# Altium project SparkControl.PrjPcb
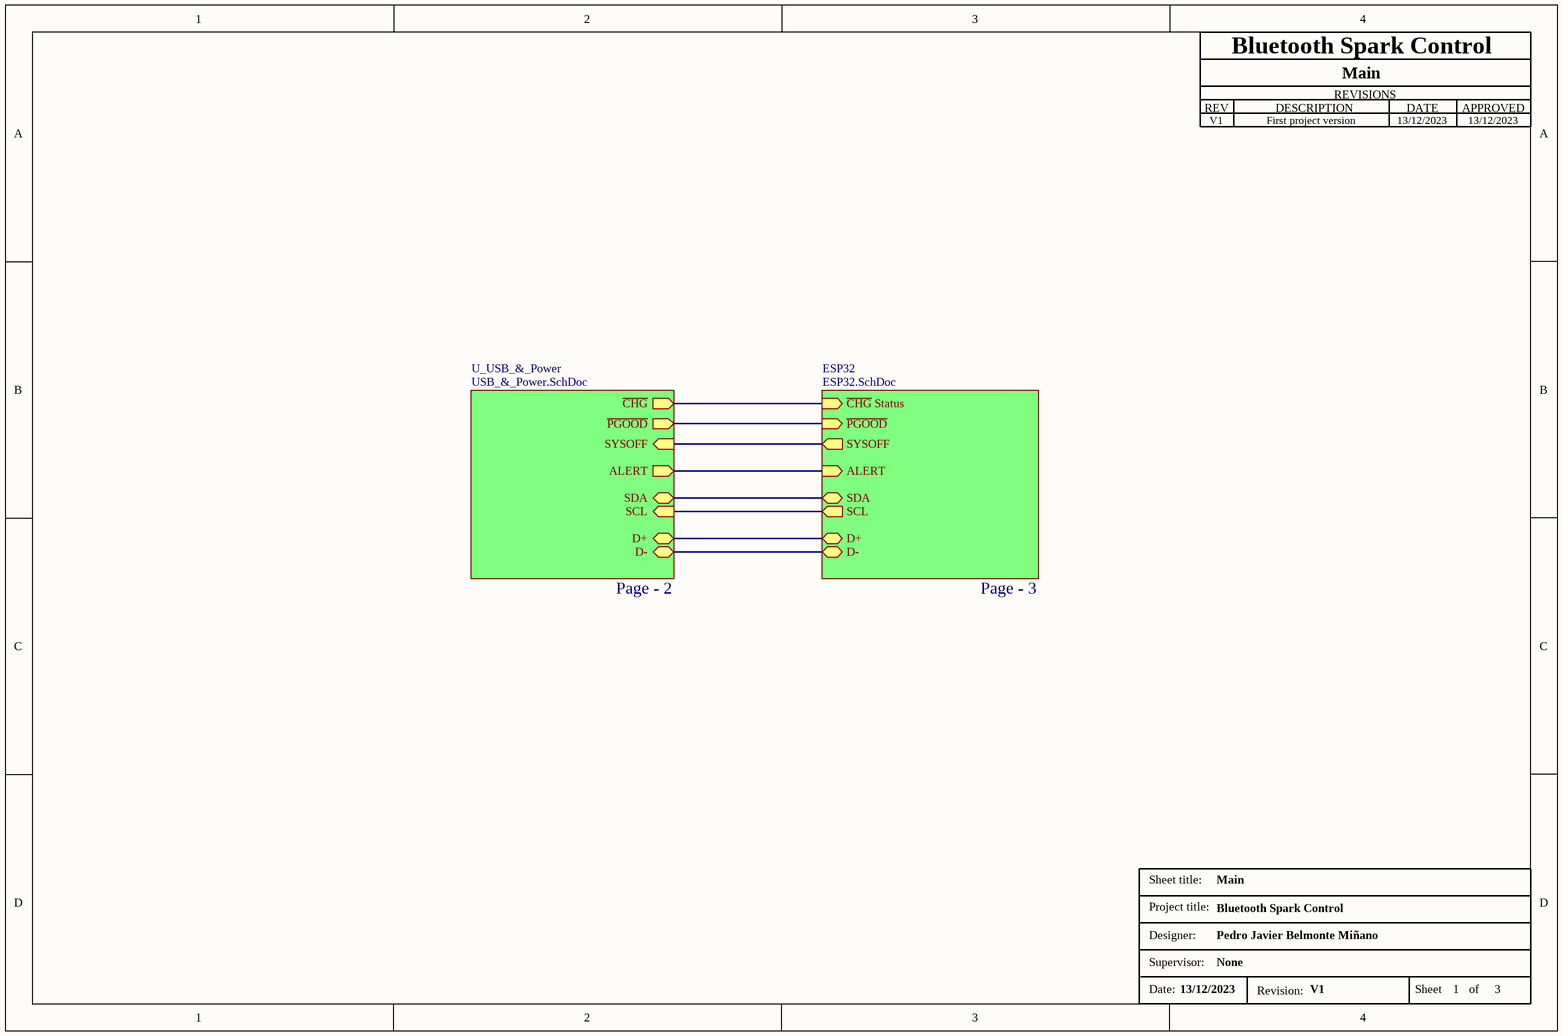
[diagram p0: Main.SchDoc]
ProjectRev: V1; ProjectDate: 13/12/2023; ProjectSupervisor: None; ProjectEngineer: Pedro Javier Belmonte Miñano; ProjectTitle: Bluetooth Spark Control
3 sheets, 57 parts. Net scope: hierarchical (ports join the sheet entries above them; power ports are global).
Board file: SparkControl_V0.1.PcbDoc
Sheets:
  Main.SchDoc
    U_USB_&_Power = USB_&_Power.SchDoc
    ESP32 = ESP32.SchDoc

## Sheet Main.SchDoc: Main
size A4; SheetNumber: 1; SheetTotal: 3

### Sub-sheets
ESP32 = ESP32.SchDoc: ~{CHG} Status (in), ~{PGOOD} (in), D- (bidir), D+ (bidir), ALERT (in), SDA (bidir), SCL (out), SYSOFF (out)
U_USB_&_Power = USB_&_Power.SchDoc: ~{CHG} (out), ~{PGOOD} (out), D- (bidir), D+ (bidir), ALERT (out), SDA (bidir), SCL (in), SYSOFF (in)

### Nets
NRF_N: sheet U_USB_&_Power/D-, sheet ESP32/D-
NRF_P: sheet U_USB_&_Power/D+, sheet ESP32/D+
SCL: sheet U_USB_&_Power/SCL, sheet ESP32/SCL
SDA: sheet U_USB_&_Power/SDA, sheet ESP32/SDA
NetR1_1: sheet U_USB_&_Power/~{PGOOD}, sheet ESP32/~{PGOOD}
NetR2_1: sheet U_USB_&_Power/~{CHG}, sheet ESP32/~{CHG} Status
NetU1_15: sheet U_USB_&_Power/SYSOFF, sheet ESP32/SYSOFF
NetU3_5: sheet U_USB_&_Power/ALERT, sheet ESP32/ALERT

### Notes on the sheet
- REV
- REVISIONS
- DESCRIPTION
- DATE
- APPROVED
- Workaround for Arduino IDE:
  Edit BleKeyboard.h and put #define USE_NIMBLE before the first line
  Edit BleKeyboard.cpp and move line 17 before the first line
  Edit pins number in Config_Definitions.h
  Edit SparkButtonHandler.cpp BfButton false, HIGH to ture, LOW and line 51,53 HIGH to LOW
- V1
- First project version
- 13/12/2023
- Page - 2
- Page - 3
- Sheet title:
- Project title:
- Designer:
- Supervisor:
- Date:
- Revision:
- Sheet
- of

## Sheet USB_&_Power.SchDoc: USB & Power
size A4; DocumentNumber: 2; SheetNumber: 2; SheetTotal: 3
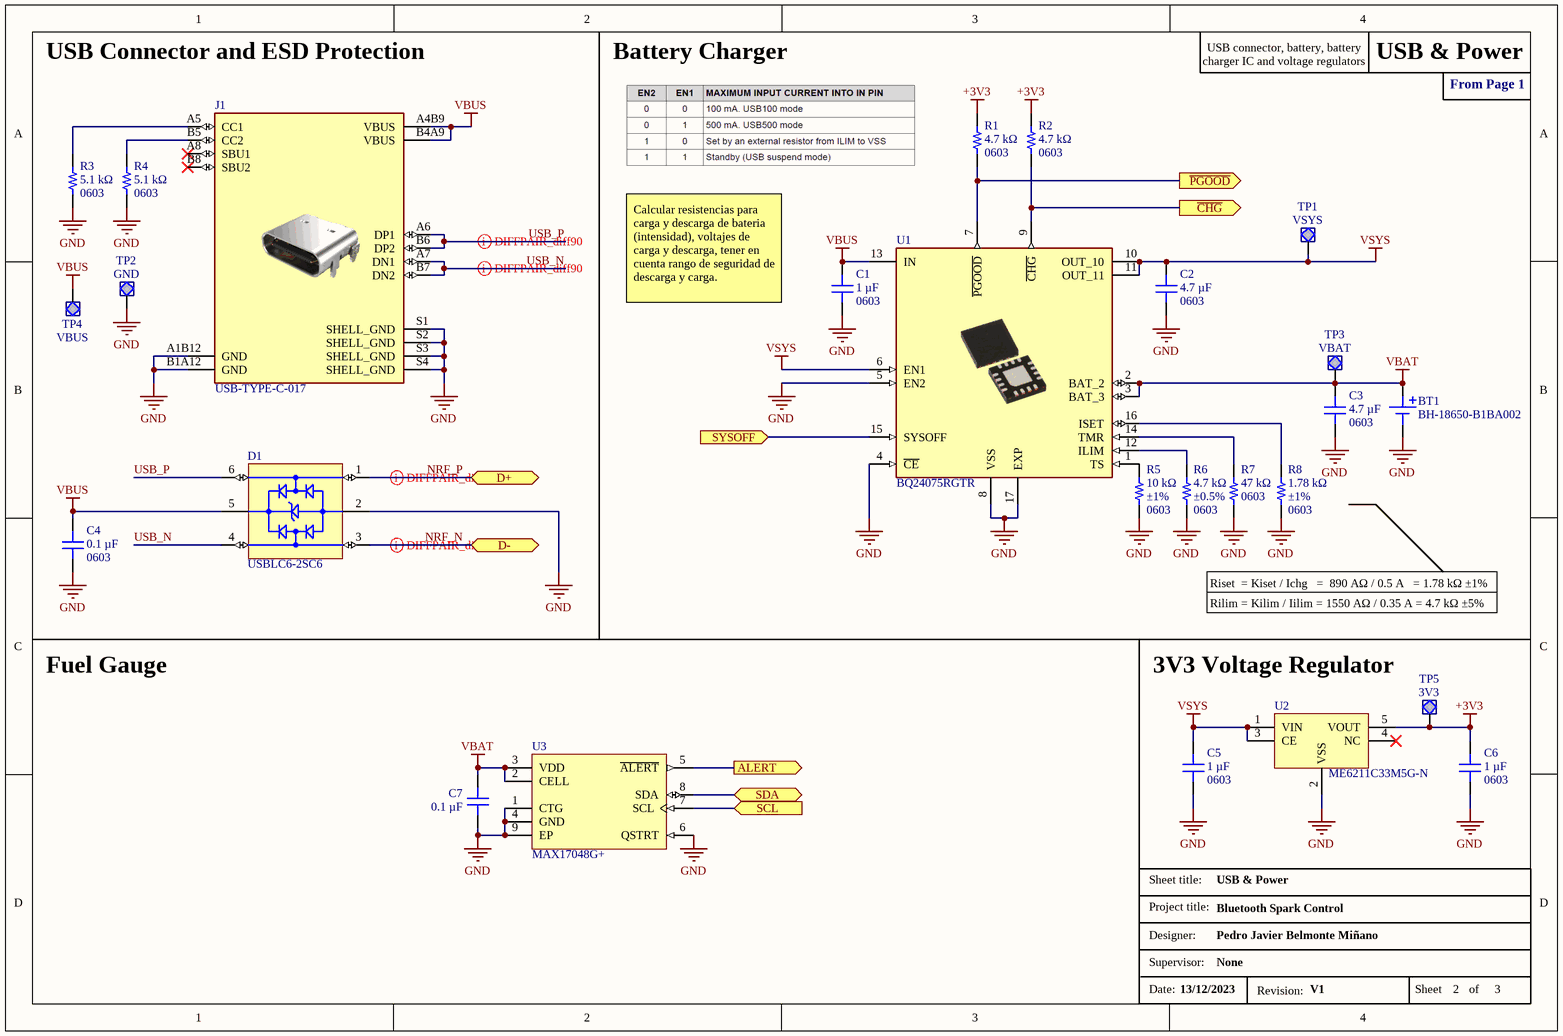
[diagram p1: USB_&_Power.SchDoc]

### Parts
BT1  BH-18650-B1BA002  [BH-18650-B1BA002]
C1  Device Package: 0603  [CAP 0603_1608]  (hidden comment: 1 µF)
C2  Device Package: 0603  [CAP 0603_1608]  (hidden comment: 4.7 µF)
C3  Device Package: 0603  [CAP 0603_1608]  (hidden comment: 4.7 µF)
C4  Device Package: 0603  [CAP 0603_1608]  (hidden comment: 0.1 µF)
C5  Device Package: 0603  [CAP 0603_1608]  (hidden comment: 1 µF)
C6  Device Package: 0603  [CAP 0603_1608]  (hidden comment: 1 µF)
C7  0.1 µF  [CAP 0603_1608]
D1  USBLC6-2SC6  [SOT95P280X145-6N]
J1  USB-TYPE-C-017  [USB-TYPE-C-017]
R1  Device Package: 0603  [RES 0603_1608]  (hidden comment: 4.7 kΩ)
R2  Device Package: 0603  [RES 0603_1608]  (hidden comment: 4.7 kΩ)
R3  Device Package: 0603  [RES 0603_1608]  (hidden comment: 5.1 kΩ)
R4  Device Package: 0603  [RES 0603_1608]  (hidden comment: 5.1 kΩ)
R5  Device Package: 0603  Tolerance: ±1%  [RES 0603_1608]  (hidden comment: 10 kΩ)
R6  Device Package: 0603  Tolerance: ±0.5%  [RES 0603_1608]  (hidden comment: 4.7 kΩ)
R7  Device Package: 0603  [RES 0603_1608]  (hidden comment: 47 kΩ)
R8  Device Package: 0603  Tolerance: ±1%  [RES 0603_1608]  (hidden comment: 1.78 kΩ)
TP1  VSYS  [TestPoint]  (no BOM)
TP2  GND  [TestPoint]  (no BOM)
TP3  VBAT  [TestPoint]  (no BOM)
TP4  VBUS  [TestPoint]  (no BOM)
TP5  3V3  [TestPoint]  (no BOM)
U1  BQ24075RGTR  [QFN50P300X300X100-17N]
U2  ME6211C33M5G-N  [SOT95P270X145-5N]
U3  MAX17048G+  [SON50P200X200X80-9N]

### Ports
ALERT (out, see Main[2B], ESP32[3B]), D+ (bidir, see Main[2C], ESP32[1D]), D- (bidir, see Main[2C], ESP32[1D]), SCL (in, see Main[2B], ESP32[4B]), SDA (bidir, see Main[2B], ESP32[4B]), SYSOFF (in, see Main[2B], ESP32[3B]), ~{CHG} (out, see Main[2B]), ~{PGOOD} (out, see Main[2B], ESP32[3A])

### Nets
+3V3: C6.2 R1.2 R2.2 TP5.1 U2.5(VOUT)
GND: BT1.N(NEG) C1.1 C2.1 C3.1 C4.1 C5.1 C6.1 C7.1 D1.2(GND) J1.A1B12(GND) J1.B1A12(GND) J1.S1(SHELL_GND) J1.S2(SHELL_GND) J1.S3(SHELL_GND) J1.S4(SHELL_GND) R3.1 R4.1 R5.1 R6.1 R7.1 R8.1 TP2.1 U1.4(~{CE}) U1.5(EN2) U1.8(VSS) U1.17(EXP) U2.2(VSS) U3.1(CTG) U3.4(GND) U3.6(QSTRT) U3.9(EP)
VBAT: BT1.P(POS) C3.2 C7.2 TP3.1 U1.2(BAT_2) U1.3(BAT_3) U3.2(CELL) U3.3(VDD)
VBUS: C1.2 C4.2 D1.5(VBUS) J1.A4B9(VBUS) J1.B4A9(VBUS) TP4.1 U1.13(IN)
VSYS: C2.2 C5.2 TP1.1 U1.6(EN1) U1.10(OUT_10) U1.11(OUT_11) U2.1(VIN) U2.3(CE)
NRF_N: D1.3(I/O_2) ; port D-
NRF_P: D1.1(I/O_1) ; port D+
SCL: U3.7(SCL) ; port SCL
SDA: U3.8(SDA) ; port SDA
USB_N: D1.4(I/O_3) J1.A7(DN1) J1.B7(DN2)
USB_P: D1.6(I/O_4) J1.A6(DP1) J1.B6(DP2)
NetJ1_A5: J1.A5(CC1) R3.2
NetJ1_B5: J1.B5(CC2) R4.2
NetR1_1: R1.1 U1.7(~{PGOOD}) ; port ~{PGOOD}
NetR2_1: R2.1 U1.9(~{CHG}) ; port ~{CHG}
NetR5_2: R5.2 U1.1(TS)
NetR6_2: R6.2 U1.12(ILIM)
NetR7_2: R7.2 U1.14(TMR)
NetR8_2: R8.2 U1.16(ISET)
NetU1_15: U1.15(SYSOFF) ; port SYSOFF
NetU3_5: U3.5(~{ALERT}) ; port ALERT

Not connected (* = marked no-connect by the designer): J1 A8(SBU1)* B8(SBU2)*; U2 4(NC)*

### Layout directives
differential pair; differential pair class diff90: NRF_N, NRF_P, USB_N, USB_P

### Notes on the sheet
- USB Connector and ESD Protection
- Battery Charger
- USB connector, battery, battery charger IC and voltage regulators
- From Page 1
- Calcular resistencias para carga y descarga de bateria (intensidad), voltajes de carga y descarga, tener en cuenta rango de seguridad de descarga y carga.
- Riset  = Kiset / Ichg   =  890 AΩ / 0.5 A   = 1.78 kΩ ±1%
- Rilim = Kilim / Iilim = 1550 AΩ / 0.35 A = 4.7 kΩ ±5%
- Fuel Gauge
- 3V3 Voltage Regulator
- Sheet title:
- Project title:
- Designer:
- Supervisor:
- Date:
- Revision:
- Sheet
- of

### Library data of the parts
BT1 = BH-18650-B1BA002: MF: MPD _Memory; MP: BH-18650-PC; Package: DFN-8 Memory Protection Devices; Value: *; Availability: Unavailable; SnapEDA_Link: https://www.snapeda.com/parts/BH-18650-PC/MPD%20%28Memory%20Protection%20Devices%29/view-part/779074/?ref=snap; Price: None
C1 C5 C6 = 0603B105K250CT: CAP CER 1UF 25V X7R 0603; manufacturer: Walsin Technology Corporation; Tolerance: ±10%; Part Number: 0603B105K250CT; Value: 1 µF; Applications: General Purpose; Capacitance: 1 µF; componentlink1description: Datasheet; componentlink1url: https://www.passivecomponent.com/wp-content/uploads/datasheet/WTC_MLCC_General_Purpose.pdf; componentlink2description: DigiKey Link; componentlink2url: https://www.digikey.com/en/products/detail/walsin-technology-corporation/0603B105K250CT/14836817; lastupdated: 16/06/2023 19:14:03; Lifecycle Status: Active; Minimum Order: 1; Mounting Type: Surface Mount, MLCC; Operating Temperature: -55°C ~ 125°C; Package / Case: 0603 (1608 Metric); packaging: TapeAndReel; partid: 41189; Part Status: Active; price: 0.03; series: -; Size / Dimension: 0.063" L x 0.031" W (1.60mm x 0.80mm); Supplier 1: DigiKey; Supplier Part Number 1: 1292-0603B105K250CT-ND; Temperature Coefficient: X7R; Thickness (Max): 0.037" (0.95mm); Voltage - Rated: 25V
C2 C3 = 0603YW475KAT2A: CAP CER 4.7UF 16V X6S 0603; manufacturer: KYOCERA AVX; Tolerance: ±10%; Part Number: 0603YW475KAT2A; Value: 4.7 µF; Applications: General Purpose; Capacitance: 4.7 µF; componentlink1description: Datasheet; componentlink1url: https://catalogs.kyocera-avx.com/SurfaceMount.pdf; componentlink2description: DigiKey Link; componentlink2url: https://www.digikey.com/en/products/detail/kyocera-avx/0603YW475KAT2A/14112130; lastupdated: 16/06/2023 19:14:19; Lifecycle Status: Active; Minimum Order: 1; Mounting Type: Surface Mount, MLCC; Operating Temperature: -55°C ~ 105°C; Package / Case: 0603 (1608 Metric); packaging: TapeAndReel; partid: 35833; Part Status: Active; price: 0.07; series: -; Size / Dimension: 0.063" L x 0.031" W (1.60mm x 0.80mm); Supplier 1: DigiKey; Supplier Part Number 1: 478-0603YW475KAT2ACT-ND; Temperature Coefficient: X6S; Thickness (Max): 0.039" (1.00mm); Voltage - Rated: 16V
C4 = 100X14W104MV4T: CAP CER 0.1UF 10V X7R 0603; manufacturer: Johanson Dielectrics Inc.; Tolerance: ±20%; Part Number: 100X14W104MV4T; Value: 0.1 µF; Applications: Bypass, Decoupling; Capacitance: 0.1 µF; componentlink1description: Datasheet; componentlink1url: https://www.johansondielectrics.com/downloads/x2y-filter-and-decoupling-capacitors.pdf; componentlink2description: DigiKey Link; componentlink2url: https://www.digikey.com/en/products/detail/johanson-dielectrics-inc/100X14W104MV4T/1655914; Features: Low ESL (X2Y); lastupdated: 16/06/2023 19:15:23; Lifecycle Status: Active; Minimum Order: 1; Mounting Type: Surface Mount, MLCC; Operating Temperature: -55°C ~ 125°C; Package / Case: 0603 (1608 Metric); packaging: TapeAndReel; partid: 2680; Part Status: Active; price: 0.08; series: X2Y®; Size / Dimension: 0.064" L x 0.035" W (1.63mm x 0.89mm); Supplier 1: DigiKey; Supplier Part Number 1: 709-1101-1-ND; Temperature Coefficient: X7R; Thickness (Max): 0.026" (0.66mm); Voltage - Rated: 10V
C7 = C0603C104K5RAC7411: CAP CER 0.1UF 50V X7R 0603; manufacturer: KEMET; Tolerance: ±10%; Part Number: C0603C104K5RAC7411; Value: 0.1 µF; Applications: Bypass, Decoupling; Capacitance: 0.1 µF; componentlink1description: Datasheet; componentlink1url: https://api.kemet.com/component-edge/download/datasheet/C0603C104K5RAC7411.pdf; componentlink2description: DigiKey Link; componentlink2url: https://www.digikey.com/en/products/detail/kemet/C0603C104K5RAC7411/3317013; Device Package: 0603 (1608 Metric); lastupdated: 10/08/2023 19:08:04; Lifecycle Status: Active; Minimum Order: 1; Mounting Type: Surface Mount, MLCC; Operating Temperature: -55°C ~ 125°C; Package / Case: 0603 (1608 Metric); packaging: TapeAndReel; partid: 2233; Part Status: Active; price: 0.01; series: SMD Comm X7R; Size / Dimension: 0.063" L x 0.031" W (1.60mm x 0.80mm); Supplier 1: DigiKey; Supplier Part Number 1: 399-C0603C104K5RAC7411CT-ND; Temperature Coefficient: X7R; Thickness (Max): 0.035" (0.90mm); Voltage - Rated: 50V
D1 = USBLC6-2SC6: Very low capacitance ESD protection, 3.5 pF, -40 to 125 degC, 6-Pin SOT23, RoHS, Tape and Reel; Manufacturer: STMicroelectronics; Polarity: Uni-Directional; Clamping Voltage: 17V; Rad Hardened: No; Product Height (mm): 1.3mm; Leakage Current (Max): 0.15uA; Product Length (mm): 3.05mm; Number of Elements: 1; Peak Pulse Current: 5A; Configuration: Dual; Reverse Breakdown Voltage: 6V; Working Voltage (Max): 5V; Capacitance Value: 3.5pF; Suppressor Type: DiodeArrays; Product Depth (mm): 1.75mm; Test Current (It): 1mA; Package / Case: SOT-23; Operating Temperature Max Deg. C: 125C; Package Description: 6-Pin Small Outline Transistor, Body 2.925 x 1.625 mm, Pitch 0.95 mm; Package Reference: SOT23-6L; Datasheet Version: Rev. 5, 10/2011; Operating Temperature Min Deg. C: -40C; Mounting Style: SurfaceMount; Direction Type: Uni-Directional; Mounting: SurfaceMount; Pin Count: 6; Leakage Current: 0.15uA; Packaging: TapeandReel; Operating Temperature Classification: Automotive; Clamping Voltage (Max): 17V; Manufacturer URL: http://www.st.com/; Reverse Stand-off Voltage: 5V; Datasheet URL: http://www.st.com/st-web-ui/static/active/en/resource/technical/document/datasheet/CD00050750.pdf; Working Voltage: 5V; Operating Temp Range: -40Cto125C; Manufacturer Part Number: USBLC6-2SC6; Category: Diode
J1 = USB-TYPE-C-017: 3A 1 Surface Mount 16P Female -25℃~+85℃ Type-C SMD USB Connectors ROHS; MF: Valcon; MP: CSP-USC16-TR; Package: None; Price: None; Value: *; Purchase-URL: https://pricing.snapeda.com/search/part/CSP-USC16-TR/?ref=eda; SnapEDA_Link: https://www.snapeda.com/parts/CSP-USC16-TR/Valcon/view-part/?ref=snap; Check_prices: https://www.snapeda.com/parts/CSP-USC16-TR/Valcon/view-part/?ref=eda; Availability: In Stock
R1 R2 R6 = ERA-3AEB472V: RES SMD 4.7K OHM 0.1% 1/10W 0603; Manufacturer: Panasonic Electronic Components; Power (Watts): 0.1W, 1/10W; Resistance: 4.7 kOhms; Temperature Coefficient: ±25ppm/°C; Part Number: ERA-3AEB472V; Value: 4.7 kΩ; ComponentLink1Description: Datasheet; ComponentLink1URL: https://industrial.panasonic.com/cdbs/www-data/pdf/RDM0000/AOA0000C307.pdf; ComponentLink2Description: DigiKey Link; ComponentLink2URL: https://www.digikey.com/en/products/detail/panasonic-electronic-components/ERA-3AEB472V/1465870; Composition: Thin Film; Features: Automotive AEC-Q200; Height - Seated (Max): 0.022" (0.55mm); LastUpdated: 02/08/2023 19:13:59; Lifecycle Status: Active; Minimum Order: 1; Number of Terminations: 2; Operating Temperature: -55°C ~ 155°C; Package / Case: 0603 (1608 Metric); Packaging: TapeAndReel; PartId: 5519; Part Status: Active; Price: 0.03; Ratings: AEC-Q200; Series: ERA-3A; Size / Dimension: 0.063" L x 0.031" W (1.60mm x 0.80mm); Supplier 1: DigiKey; Supplier Part Number 1: P4.7KDBCT-ND; Supplier Device Package: 0603
  R1 R2: Tolerance: ±0.1%
R3 R4 = RMCF0603JG5K10: RES 5.1K OHM 5% 1/10W 0603; Manufacturer: Stackpole Electronics Inc; Power (Watts): 0.1W, 1/10W; Resistance: 5.1 kOhms; Temperature Coefficient: ±200ppm/°C; Part Number: RMCF0603JG5K10; Value: 5.1 kΩ; ComponentLink1Description: Datasheet; ComponentLink1URL: https://www.seielect.com/catalog/sei-packaging.pdf; ComponentLink2Description: DigiKey Link; ComponentLink2URL: https://www.digikey.com/en/products/detail/stackpole-electronics-inc/RMCF0603JG5K10/1712287; Composition: Thick Film; Features: Automotive AEC-Q200; Height - Seated (Max): 0.022" (0.55mm); LastUpdated: 16/06/2023 19:45:34; Lifecycle Status: Active; Minimum Order: 1; Number of Terminations: 2; Operating Temperature: -55°C ~ 155°C; Package / Case: 0603 (1608 Metric); Packaging: CutTape; PartId: 5180; Part Status: Active; Price: 0.01; Ratings: AEC-Q200; Series: RMCF; Size / Dimension: 0.061" L x 0.031" W (1.55mm x 0.80mm); Supplier 1: DigiKey; Supplier Part Number 1: 738-RMCF0603JG5K10CT-ND; Supplier Device Package: 0603; Tolerance: ±5%
R5 = RT0603FRE0710KL: RES SMD 10K OHM 1% 1/10W 0603; Manufacturer: Yageo; Power (Watts): 0.1W, 1/10W; Resistance: 10 kOhms; Temperature Coefficient: ±50ppm/°C; Part Number: RT0603FRE0710KL; Value: 10 kΩ; ComponentLink1Description: Datasheet; ComponentLink1URL: https://www.yageo.com/upload/media/product/productsearch/datasheet/rchip/PYu-RT_1-to-0.01_RoHS_L_11.pdf; ComponentLink2Description: DigiKey Link; ComponentLink2URL: https://www.digikey.com/en/products/detail/yageo/RT0603FRE0710KL/1075040; Composition: Thin Film; Height - Seated (Max): 0.022" (0.55mm); LastUpdated: 16/06/2023 19:45:32; Lifecycle Status: Active; Minimum Order: 1; Number of Terminations: 2; Operating Temperature: -55°C ~ 155°C; Package / Case: 0603 (1608 Metric); Packaging: TapeAndReel; PartId: 5671; Part Status: Active; Price: 0.01; Series: RT; Size / Dimension: 0.063" L x 0.031" W (1.60mm x 0.80mm); Supplier 1: DigiKey; Supplier Part Number 1: YAG2321CT-ND; Supplier Device Package: 0603
R7 = RCS060347K0JNEA: RES SMD 47K OHM 5% 1/4W 0603; Manufacturer: Vishay Dale; Power (Watts): 0.25W, 1/4W; Resistance: 47 kOhms; Temperature Coefficient: ±200ppm/°C; Part Number: RCS060347K0JNEA; Value: 47 kΩ; ComponentLink1Description: Datasheet; ComponentLink1URL: http://www.vishay.com/docs/20065/rcse3.pdf; ComponentLink2Description: DigiKey Link; ComponentLink2URL: https://www.digikey.com/en/products/detail/vishay-dale/RCS060347K0JNEA/5866965; Composition: Thick Film; Features: Automotive AEC-Q200, Pulse Withstanding; Height - Seated (Max): 0.020" (0.50mm); LastUpdated: 09/08/2023 19:48:23; Lifecycle Status: Active; Minimum Order: 1; Number of Terminations: 2; Operating Temperature: -55°C ~ 155°C; Package / Case: 0603 (1608 Metric); Packaging: TapeAndReel; PartId: 5445; Part Status: Active; Price: 0.01; Ratings: AEC-Q200; Series: RCS e3; Size / Dimension: 0.061" L x 0.033" W (1.55mm x 0.85mm); Supplier 1: DigiKey; Supplier Part Number 1: 541-2819-1-ND; Supplier Device Package: 0603; Tolerance: ±5%
R8 = RNCP0603FTD1K78: RES 1.78K OHM 1% 1/8W 0603; Manufacturer: Stackpole Electronics Inc; Power (Watts): 0.125W, 1/8W; Resistance: 1.78 kOhms; Temperature Coefficient: ±100ppm/°C; Part Number: RNCP0603FTD1K78; Value: 1.78 kΩ; ComponentLink1Description: Datasheet; ComponentLink1URL: https://www.seielect.com/catalog/sei-rncp.pdf; ComponentLink2Description: DigiKey Link; ComponentLink2URL: https://www.digikey.com/en/products/detail/stackpole-electronics-inc/RNCP0603FTD1K78/2240112; Composition: Thin Film; Features: Anti-Sulfur; Height - Seated (Max): 0.022" (0.55mm); LastUpdated: 16/06/2023 19:45:23; Lifecycle Status: Active; Minimum Order: 1; Number of Terminations: 2; Operating Temperature: -55°C ~ 155°C; Package / Case: 0603 (1608 Metric); Packaging: TapeAndReel; PartId: 6979; Part Status: Active; Price: 0.01; Series: RNCP; Size / Dimension: 0.061" L x 0.031" W (1.55mm x 0.80mm); Supplier 1: DigiKey; Supplier Part Number 1: RNCP0603FTD1K78CT-ND; Supplier Device Package: 0603
TP1-TP5 = TestPoint
U1 = BQ24075RGTR: Standalone 1-cell 1.5-A linear charger, Power Path, 4.2-V VBAT and 5.5-V VOUT 16-VQFN -40 to 85; Package: None; Value: *; MP: BQ24075RGTR; Availability: Unavailable; Price: None
U2 = ME6211C33M5G-N: Fixed 6V 3.3V 500mA SOT-23-5 Low Dropout Regulators(LDO) RoHS; Manufacturer_Name: Microne; Geometry.Height: 1.45mm; Manufacturer_Part_Number: ME6211C33M5G-N; Mouser Part Number: *; Mouser Price/Stock: *; Arrow Part Number: *; Arrow Price/Stock: *; Datasheet Link: https://datasheet.lcsc.com/szlcsc/1811131510_MICRONE-Nanjing-Micro-One-Elec-ME6211C33M5G-N_C82942.pdf
U3 = MAX17048G+: Battery Battery Monitor IC Lithium-Ion 8-TDFN-EP _2x2_; MF: Maxim Integrated; Value: *; SnapEDA_Link: https://www.snapeda.com/parts/MAX17048G%2B/Maxim%20Integrated/view-part/295942/?ref=snap; Price: None; Availability: Unavailable; Package: TDFN-8 Maxim; MP: MAX17048G+

## Sheet ESP32.SchDoc: ESP32 & CH340C
size A4; SheetNumber: 3; SheetTotal: 3
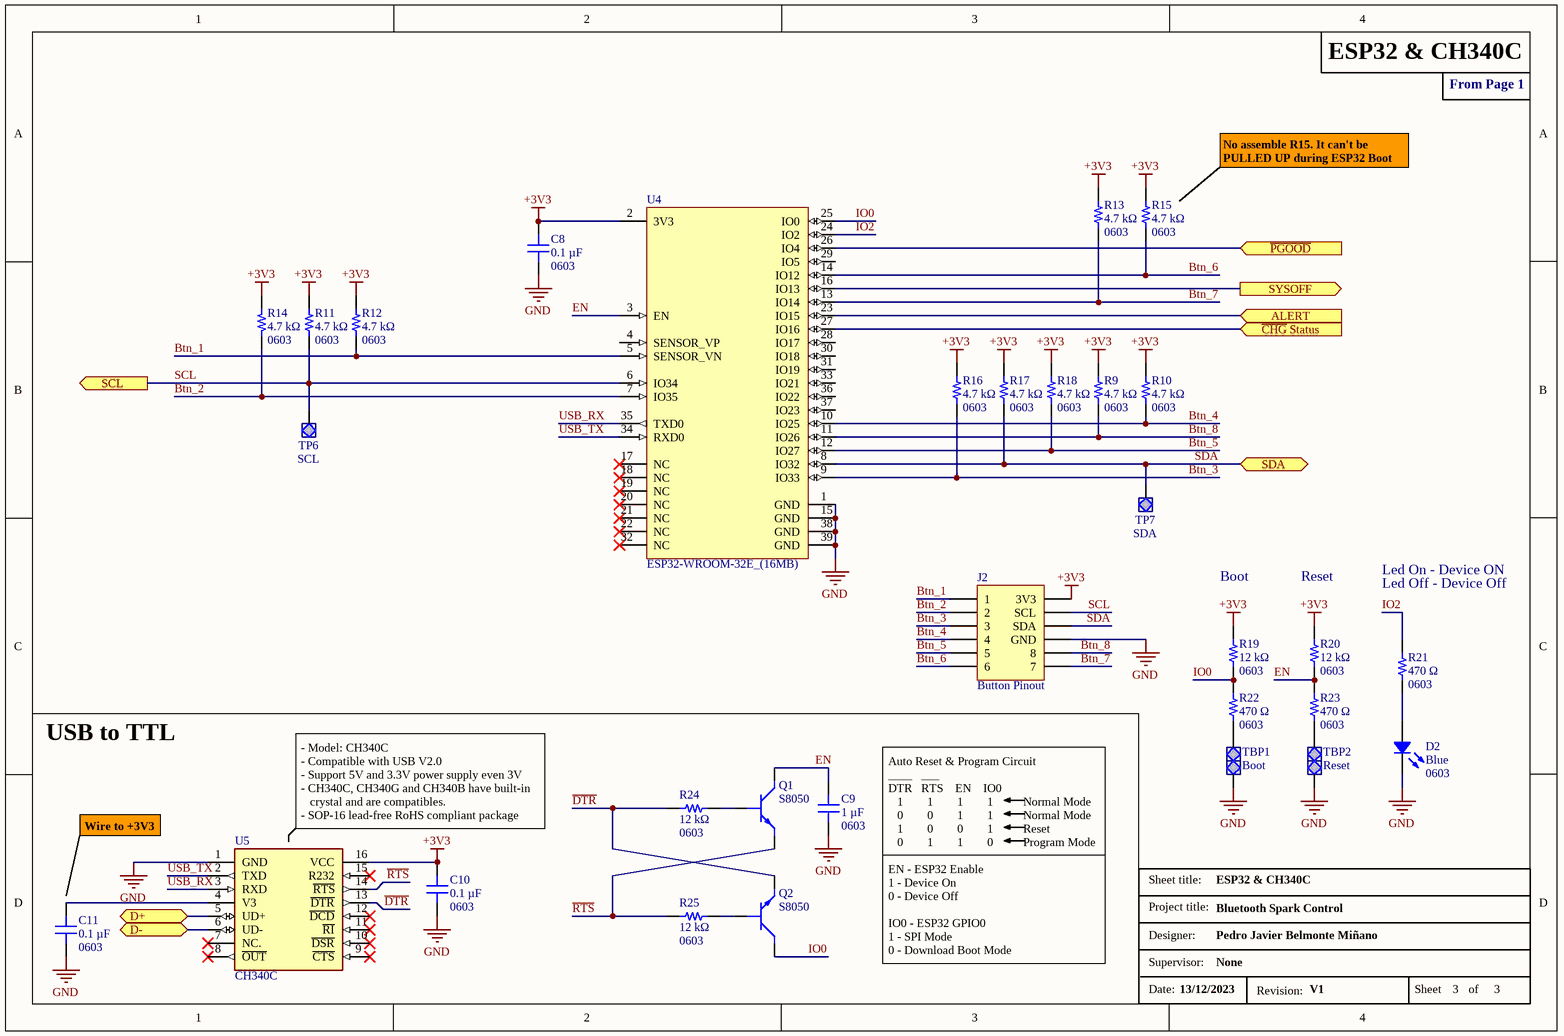
[diagram p2: ESP32.SchDoc]

### Parts
C8  Device Package: 0603  [CAP 0603_1608]  (hidden comment: 0.1 µF)
C9  Device Package: 0603  [CAP 0603_1608]  (hidden comment: 1 µF)
C10  Device Package: 0603  [CAP 0603_1608]  (hidden comment: 0.1 µF)
C11  Device Package: 0603  [CAP 0603_1608]  (hidden comment: 0.1 µF)
D2  Blue  Size: 0603  [LED 0603_1608 BLUE]
J2  Button Pinout  [PINOUT]
Q1  S8050  [SOT95P240X115-3N]
Q2  S8050  [SOT95P240X115-3N]
R9  Device Package: 0603  [RES 0603_1608]  (hidden comment: 4.7 kΩ)
R10  Device Package: 0603  [RES 0603_1608]  (hidden comment: 4.7 kΩ)
R11  Device Package: 0603  [RES 0603_1608]  (hidden comment: 4.7 kΩ)
R12  Device Package: 0603  [RES 0603_1608]  (hidden comment: 4.7 kΩ)
R13  Device Package: 0603  [RES 0603_1608]  (hidden comment: 4.7 kΩ)
R14  Device Package: 0603  [RES 0603_1608]  (hidden comment: 4.7 kΩ)
R15  Device Package: 0603  [RES 0603_1608]  (hidden comment: 4.7 kΩ)
R16  Device Package: 0603  [RES 0603_1608]  (hidden comment: 4.7 kΩ)
R17  Device Package: 0603  [RES 0603_1608]  (hidden comment: 4.7 kΩ)
R18  Device Package: 0603  [RES 0603_1608]  (hidden comment: 4.7 kΩ)
R19  12 kΩ  Size: 0603  [RES 0603_1608]
R20  12 kΩ  Size: 0603  [RES 0603_1608]
R21  470 Ω  Size: 0603  [RES 0603_1608]
R22  470 Ω  Size: 0603  [RES 0603_1608]
R23  470 Ω  Size: 0603  [RES 0603_1608]
R24  12 kΩ  Size: 0603  [RES 0603_1608]
R25  12 kΩ  Size: 0603  [RES 0603_1608]
TBP1  Boot  [Tweezer-bridgeable Pads]  (no BOM)
TBP2  Reset  [Tweezer-bridgeable Pads]  (no BOM)
TP6  SCL  [TestPoint]  (no BOM)
TP7  SDA  [TestPoint]  (no BOM)
U4  ESP32-WROOM-32E_(16MB)  [XCVR_ESP32-WROOM-32E_(16MB)]
U5  CH340C  [SOIC127P600X180-16N]

### Blocks framed on the sheet
USB to TTL: C9-C11 Q1 Q2 R24 R25 U5

### Ports
ALERT (in, see Main[3B], USB_&_Power[2C]), D+ (bidir, see Main[3C], USB_&_Power[2B]), D- (bidir, see Main[3C], USB_&_Power[2C]), SCL (out, see Main[3B], USB_&_Power[2D]), SDA (bidir, see Main[3B], USB_&_Power[2D]), SYSOFF (out, see Main[3B], USB_&_Power[2B]), ~{CHG} Status (in, see Main[3B]), ~{PGOOD} (in, see Main[3B], USB_&_Power[4A])

### Nets
+3V3: C8.2 C10.2 J2.12(3V3) R9.2 R10.2 R11.2 R12.2 R13.2 R14.2 R15.2 R16.2 R17.2 R18.2 R19.1 R20.1 U4.2(3V3) U5.16(VCC)
GND: C8.1 C9.1 C10.1 C11.1 D2.2 J2.9(GND) TBP1.2 TBP2.2 U4.1(GND) U4.15(GND) U4.38(GND) U4.39(GND) U5.1(GND)
Btn_1: J2.1 R12.1 U4.5(SENSOR_VN)
Btn_2: J2.2 R14.1 U4.7(IO35)
Btn_3: J2.3 R16.1 U4.9(IO33)
Btn_4: J2.4 R10.1 U4.10(IO25)
Btn_5: J2.5 R18.1 U4.12(IO27)
Btn_6: J2.6 R15.1 U4.14(IO12)
Btn_7: J2.7 R13.1 U4.13(IO14)
Btn_8: J2.8 R9.1 U4.11(IO26)
~{DTR}: Q2.3(E) R24.1 U5.13(~{DTR})
EN: C9.2 Q1.2(C) R20.2 R23.1 U4.3(EN)
IO0: Q2.2(C) R19.2 R22.1 U4.25(IO0)
IO2: R21.1 U4.24(IO2)
NRF_N: U5.6(UD-) ; port D-
NRF_P: U5.5(UD+) ; port D+
~{RTS}: Q1.3(E) R25.1 U5.14(~{RTS})
SCL: J2.11(SCL) R11.1 TP6.1 U4.6(IO34) ; port SCL
SDA: J2.10(SDA) R17.1 TP7.1 U4.8(IO32) ; port SDA
USB_RX: U4.35(TXD0) U5.3(RXD)
USB_TX: U4.34(RXD0) U5.2(TXD)
NetC11_2: C11.2 U5.4(V3)
NetD2_1: D2.1 R21.2
NetQ1_1: Q1.1(B) R24.2
NetQ2_1: Q2.1(B) R25.2
NetR1_1: U4.26(IO4) ; port ~{PGOOD}
NetR2_1: U4.27(IO16) ; port ~{CHG} Status
NetR22_2: R22.2 TBP1.1
NetR23_2: R23.2 TBP2.1
NetU1_15: U4.16(IO13) ; port SYSOFF
NetU3_5: U4.23(IO15) ; port ALERT

Not connected (* = marked no-connect by the designer): U4 4(SENSOR_VP) 17(NC)* 18(NC)* 19(NC)* 20(NC)* 21(NC)* 22(NC)* 28(IO17) 29(IO5) 30(IO18) 31(IO19) 32(NC)* 33(IO21) 36(IO22) 37(IO23); U5 7(NC.)* 8(~{OUT})* 9(~{CTS})* 10(~{DSR})* 11(~{RI})* 12(~{DCD})* 15(R232)*

### Notes on the sheet
- From Page 1
- No assemble R15. It can't be PULLED UP during ESP32 Boot
- Boot
- Reset
- Led On - Device ON
- Led Off - Device Off
- Wire to +3V3
- - Model: CH340C
  - Compatible with USB V2.0
  - Support 5V and 3.3V power supply even 3V
  - CH340C, CH340G and CH340B have built-in
  crystal and are compatibles.
  - SOP-16 lead-free RoHS compliant package
- Auto Reset & Program Circuit
  ____   ___
  DTR   RTS    EN    IO0
  1        1        1        1	         Normal Mode
  0        0        1        1          Normal Mode
  1        0        0        1          Reset
  0        1        1        0          Program Mode
- EN - ESP32 Enable
  1 - Device On
  0 - Device Off
  IO0 - ESP32 GPIO0
  1 - SPI Mode
  0 - Download Boot Mode
- Sheet title:
- Project title:
- Designer:
- Supervisor:
- Date:
- Revision:
- Sheet
- of

### Library data of the parts
C8 C10 C11 = 100X14W104MV4T: as C4 on sheet USB_&_Power; Part Number: 100X14W104MV4T; Applications: Bypass, Decoupling; Capacitance: 0.1 µF; componentlink1description: Datasheet; componentlink1url: https://www.johansondielectrics.com/downloads/x2y-filter-and-decoupling-capacitors.pdf; componentlink2description: DigiKey Link; componentlink2url: https://www.digikey.com/en/products/detail/johanson-dielectrics-inc/100X14W104MV4T/1655914; Features: Low ESL (X2Y); lastupdated: 16/06/2023 19:15:23; Lifecycle Status: Active; Minimum Order: 1; Mounting Type: Surface Mount, MLCC; Operating Temperature: -55°C ~ 125°C; Package / Case: 0603 (1608 Metric); packaging: TapeAndReel; partid: 2680; Part Status: Active; price: 0.08; series: X2Y®; Size / Dimension: 0.064" L x 0.035" W (1.63mm x 0.89mm); Supplier 1: DigiKey; Supplier Part Number 1: 709-1101-1-ND; Temperature Coefficient: X7R; Thickness (Max): 0.026" (0.66mm); Voltage - Rated: 10V; Value: 0.1 µF
C9 = 0603B105K250CT: as C1 on sheet USB_&_Power; Part Number: 0603B105K250CT; Applications: General Purpose; Capacitance: 1 µF; componentlink1description: Datasheet; componentlink1url: https://www.passivecomponent.com/wp-content/uploads/datasheet/WTC_MLCC_General_Purpose.pdf; componentlink2description: DigiKey Link; componentlink2url: https://www.digikey.com/en/products/detail/walsin-technology-corporation/0603B105K250CT/14836817; lastupdated: 16/06/2023 19:14:03; Lifecycle Status: Active; Minimum Order: 1; Mounting Type: Surface Mount, MLCC; Operating Temperature: -55°C ~ 125°C; Package / Case: 0603 (1608 Metric); packaging: TapeAndReel; partid: 41189; Part Status: Active; price: 0.03; series: -; Size / Dimension: 0.063" L x 0.031" W (1.60mm x 0.80mm); Supplier 1: DigiKey; Supplier Part Number 1: 1292-0603B105K250CT-ND; Temperature Coefficient: X7R; Thickness (Max): 0.037" (0.95mm); Voltage - Rated: 25V; Value: 1 µF
D2 = LED: LED BLUE 0603 SMD; Part Number: VLMB1300-GS08; Manufacturer: Vishay Semiconductor Opto Division; Configuration: Standard; Current - Test: 20mA; Lens Color: 1.00mm; Lens Size: 1.10mm x 0.80mm; Lens Style: Rectangle with Flat Top; Millicandela Rating: 104mcd; Viewing Angle: 130°; Voltage - Forward (Vf) (Typ): 3.3V; Wavelength - Dominant: 470nm; Wavelength - Peak: 468nm; Color: Blue; ComponentLink1Description: Datasheet; ComponentLink1URL: http://www.vishay.com/docs/82437/vlmo1300.pdf; ComponentLink2Description: DigiKey Link; ComponentLink2URL: http://digikey.com/product-detail/en/vishay-semiconductor-opto-division/VLMB1300-GS08/VLMB1300-GS08CT-ND/3025485; Device Package: 0603 (1608 Metric); Height (Max): 1.00mm; LastUpdated: 09/02/2020 01:20:26; Lifecycle Status: Active; Minimum Order: 1; Mounting Type: Surface Mount; Package / Case: 0603 (1608 Metric); Packaging: TapeAndReel; PartId: 785; Part Status: Active; Price: 0.08; Series: CHIPLED; Size / Dimension: 1.60mm L x 0.80mm W; Supplier 1: DigiKey; Supplier Part Number 1: VLMB1300-GS08CT-ND; Supplier Device Package: 0603; Value: Blue; Category: LED
Q1 Q2 = S8050: Transistor; Manufacturer_Name: Yenji Elec; Datasheet Link: https://datasheet.lcsc.com/szlcsc/Yenji-Elec-S8050_C139514.pdf; Height: 1.15mm; Manufacturer_Part_Number: S8050; Category: BJT Transistor
R9-R18 = ERA-3AEB472V: as R1 on sheet USB_&_Power; Part Number: ERA-3AEB472V; ComponentLink1Description: Datasheet; ComponentLink1URL: https://industrial.panasonic.com/cdbs/www-data/pdf/RDM0000/AOA0000C307.pdf; ComponentLink2Description: DigiKey Link; ComponentLink2URL: https://www.digikey.com/en/products/detail/panasonic-electronic-components/ERA-3AEB472V/1465870; Composition: Thin Film; Features: Automotive AEC-Q200; Height - Seated (Max): 0.022" (0.55mm); LastUpdated: 02/08/2023 19:13:59; Lifecycle Status: Active; Minimum Order: 1; Number of Terminations: 2; Operating Temperature: -55°C ~ 155°C; Package / Case: 0603 (1608 Metric); Packaging: TapeAndReel; PartId: 5519; Part Status: Active; Price: 0.03; Ratings: AEC-Q200; Series: ERA-3A; Size / Dimension: 0.063" L x 0.031" W (1.60mm x 0.80mm); Supplier 1: DigiKey; Supplier Part Number 1: P4.7KDBCT-ND; Supplier Device Package: 0603; Tolerance: ±0.1%; Value: 4.7 kΩ
R19 R20 R24 R25 = RMCF0603JT12K0: RES 12K OHM 5% 1/10W 0603; Manufacturer: Stackpole Electronics Inc; Power (Watts): 0.1W, 1/10W; Resistance: 12 kOhms; Temperature Coefficient: ±200ppm/°C; Part Number: RMCF0603JT12K0; ComponentLink1Description: Datasheet; ComponentLink1URL: https://www.seielect.com/catalog/sei-rmcf_rmcp.pdf; ComponentLink2Description: DigiKey Link; ComponentLink2URL: http://digikey.com/product-detail/en/stackpole-electronics-inc/RMCF0603JT12K0/RMCF0603JT12K0CT-ND/1943192; Composition: Thick Film; Device Package: 0603 (1608 Metric); Features: Automotive AEC-Q200; Height - Seated (Max): 0.022" (0.55mm); LastUpdated: 09/02/2020 01:10:24; Lifecycle Status: Active; Minimum Order: 1; Number of Terminations: 2; Operating Temperature: -55°C ~ 155°C; Package / Case: 0603 (1608 Metric); Packaging: CutTape; PartId: 5166; Part Status: Active; Price: 0.10; Ratings: AEC-Q200; Series: RMCF; Size / Dimension: 0.061" L x 0.031" W (1.55mm x 0.80mm); Supplier 1: DigiKey; Supplier Part Number 1: RMCF0603JT12K0CT-ND; Supplier Device Package: 0603; Tolerance: ±5%; Value: 12 kΩ; Category: Res
R21-R23 = RMCF0603JT470R: RES 470 OHM 5% 1/10W 0603; Manufacturer: Stackpole Electronics Inc; Power (Watts): 0.1W, 1/10W; Resistance: 470 Ohms; Temperature Coefficient: ±200ppm/°C; Part Number: RMCF0603JT470R; ComponentLink1Description: Datasheet; ComponentLink1URL: https://www.seielect.com/catalog/sei-rmcf_rmcp.pdf; ComponentLink2Description: DigiKey Link; ComponentLink2URL: http://digikey.com/product-detail/en/stackpole-electronics-inc/RMCF0603JT470R/RMCF0603JT470RCT-ND/1943166; Composition: Thick Film; Device Package: 0603 (1608 Metric); Features: Automotive AEC-Q200; Height - Seated (Max): 0.022" (0.55mm); LastUpdated: 09/02/2020 01:10:23; Lifecycle Status: Active; Minimum Order: 1; Number of Terminations: 2; Operating Temperature: -55°C ~ 155°C; Package / Case: 0603 (1608 Metric); Packaging: CutTape; PartId: 5857; Part Status: Active; Price: 0.10; Ratings: AEC-Q200; Series: RMCF; Size / Dimension: 0.061" L x 0.031" W (1.55mm x 0.80mm); Supplier 1: DigiKey; Supplier Part Number 1: RMCF0603JT470RCT-ND; Supplier Device Package: 0603; Tolerance: ±5%; Value: 470 Ω; Category: Res
TBP1 TBP2 = Tweezer-Bridgeabled Pads
TP6 TP7 = TestPoint
U4 = ESP32-WROOM-32E_(16MB): Bluetooth, WiFi 802.11b/g/n, Bluetooth v4.2 +EDR, Class 1, 2 and 3 Transceiver Module 2.4GHz ~ 2.5GHz Integrated, Trace Surface Mount; MP: ESP32-WROOM-32E (16MB); MF: Espressif Systems; Price: None; Availability: Not in stock; Package: None; Value: *; SnapEDA_Link: https://www.snapeda.com/parts/ESP32-WROOM-32E%20(16MB)/Espressif+Systems/view-part/?ref=snap; Check_prices: https://www.snapeda.com/parts/ESP32-WROOM-32E%20(16MB)/Espressif+Systems/view-part/?ref=eda
U5 = CH340C: USB to serial chip CH340; MF: WCH; Package: None; Availability: Not in stock; SnapEDA_Link: https://www.snapeda.com/parts/CH340C/WCH/view-part/?ref=snap; MP: CH340C; Check_prices: https://www.snapeda.com/parts/CH340C/WCH/view-part/?ref=eda; Value: *; Price: None; Category: Chip

## Nets that join several sheets
+3V3: USB_&_Power (5 pins), ESP32 (17 pins)
GND: USB_&_Power (31 pins), ESP32 (13 pins)
NetR1_1: USB_&_Power (R1.1 U1.7), ESP32 (U4.26)
NetR2_1: USB_&_Power (R2.1 U1.9), ESP32 (U4.27)
NetU1_15: USB_&_Power (U1.15), ESP32 (U4.16)
NetU3_5: USB_&_Power (U3.5), ESP32 (U4.23)
NRF_N: USB_&_Power (D1.3), ESP32 (U5.6)
NRF_P: USB_&_Power (D1.1), ESP32 (U5.5)
SCL: USB_&_Power (U3.7), ESP32 (J2.11 R11.1 TP6.1 U4.6)
SDA: USB_&_Power (U3.8), ESP32 (J2.10 R17.1 TP7.1 U4.8)